# Altium schematic sheet 13hdmi_lcd.SchDoc
size C
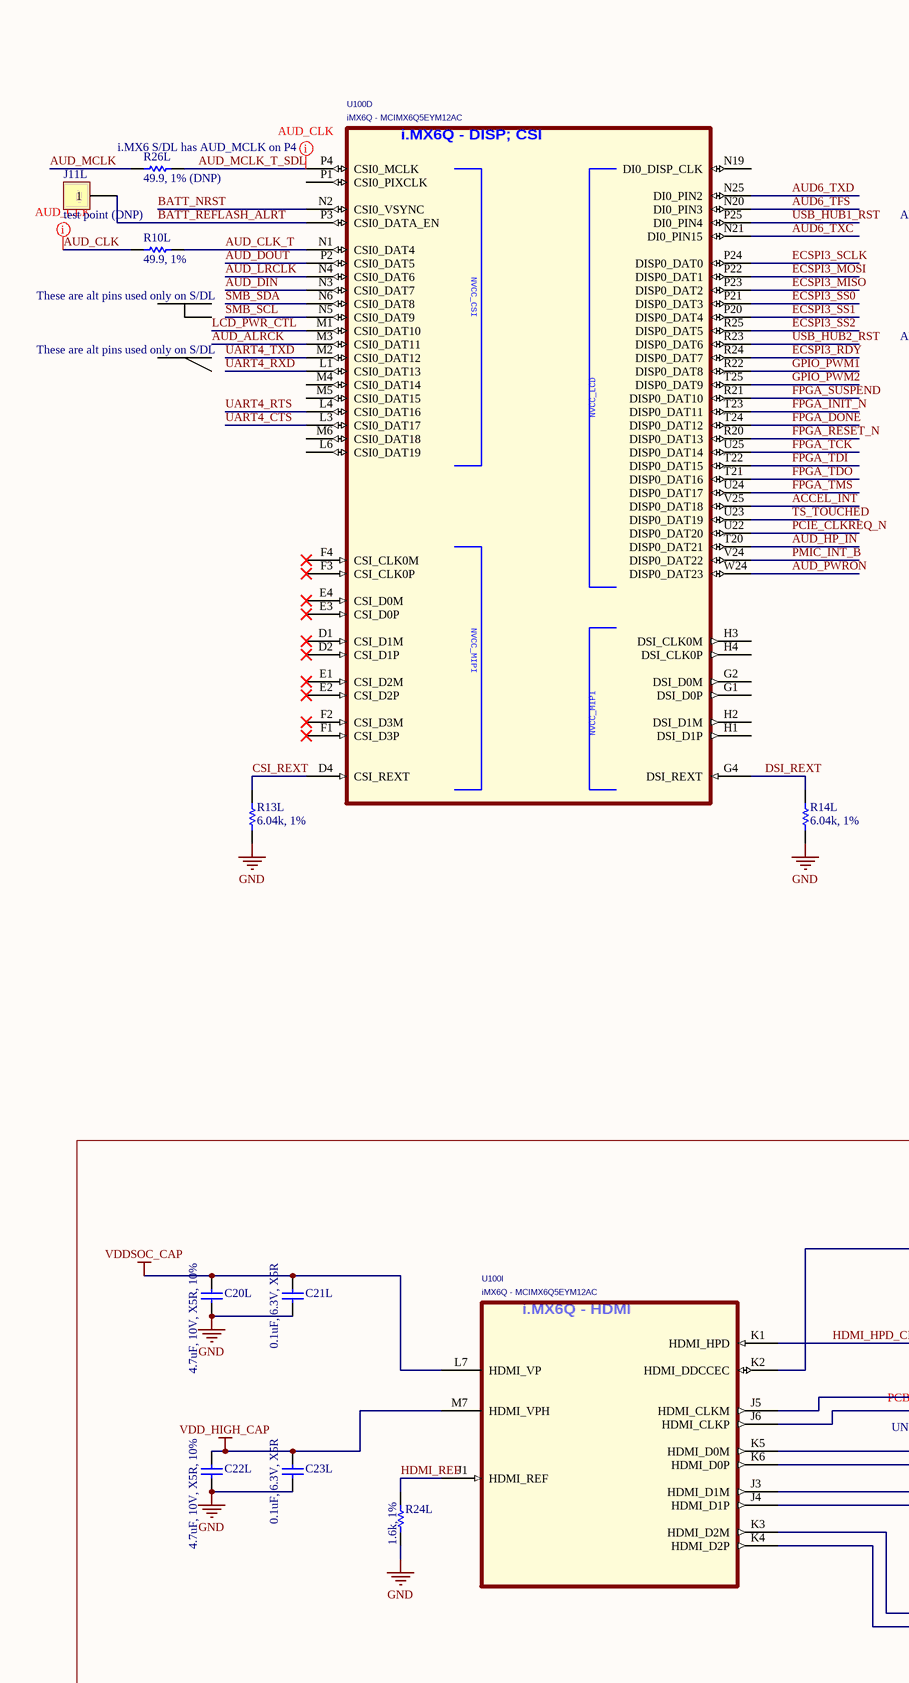
[diagram p0: 13hdmi_lcd.SchDoc, left]
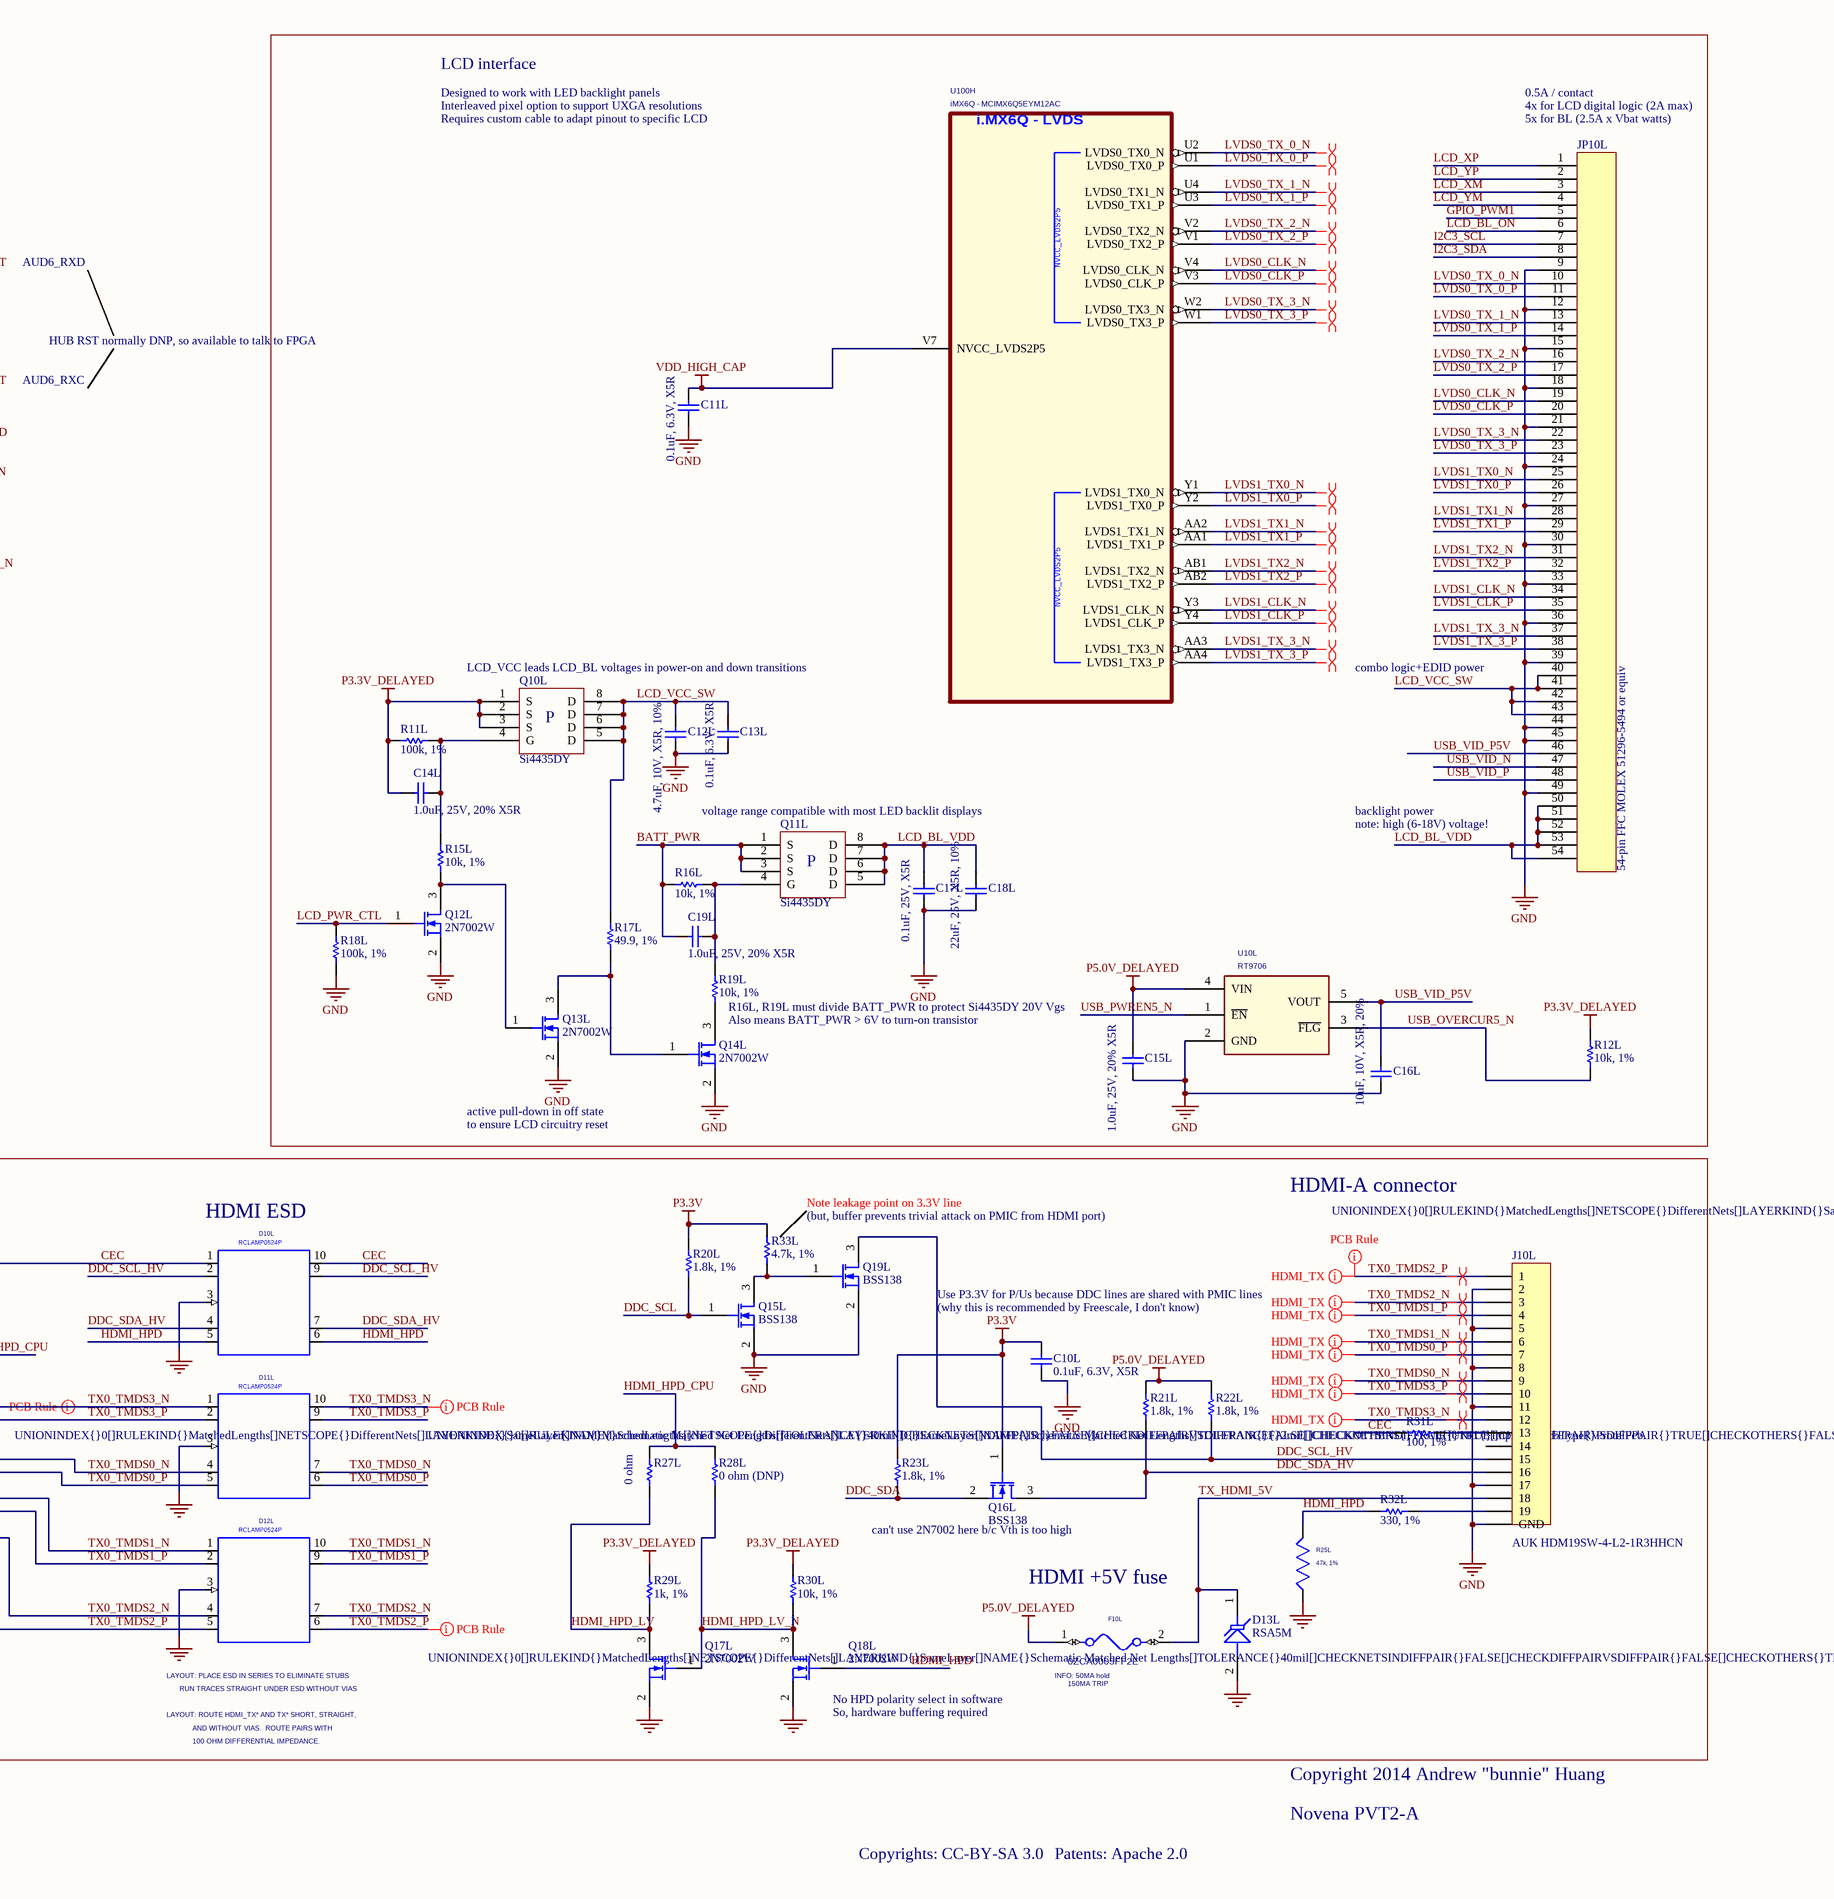
[diagram p1: 13hdmi_lcd.SchDoc, right]

## Parts
C10L  0.1uF, 6.3V, X5R  [CAPC0603N_B]
C11L  0.1uF, 6.3V, X5R  [CAPC0603N_B]
C12L  4.7uF, 10V, X5R, 10%  [CAPC1608N]
C13L  0.1uF, 6.3V, X5R  [CAPC0603N_B]
C14L  1.0uF, 25V, 20% X5R  [CAPC1608N]
C15L  1.0uF, 25V, 20% X5R  [CAPC1608N]
C16L  10uF, 10V, X5R, 20%  [CAPC1608N]
C17L  0.1uF, 25V, X5R  [CAPC1005N]
C18L  22uF, 25V, X5R, 10%  [CAPC3225N]
C19L  1.0uF, 25V, 20% X5R  [CAPC1608N]
C20L  4.7uF, 10V, X5R, 10%  [CAPC1608N_HD]
C21L  0.1uF, 6.3V, X5R  [CAPC0603N_B]
C22L  4.7uF, 10V, X5R, 10%  [CAPC1608N_HD]
C23L  0.1uF, 6.3V, X5R  [CAPC0603N_B]
D10L  RCLAMP0524P  [SEMTECH_SLP2510P8]  (value not drawn)
D11L  RCLAMP0524P  [SEMTECH_SLP2510P8]  (value not drawn)
D12L  RCLAMP0524P  [SEMTECH_SLP2510P8]  (value not drawn)
D13L  RSA5M  [SOD123/X.85]
F10L  0ZCA0005FF2E  [RESC3216N]
J10L  AUK HDM19SW-4-L2-1R3HHCN  [MOLEX_47151-0001]
J11L  test point (DNP)  [TP_SMT_38mil]
JP10L  54-pin FFC MOLEX 51296-5494 or equiv  [MOLEX_51296_5494]
Q10L  Si4435DY  [SOIC127P600-8AN]
Q11L  Si4435DY  [SOIC127P600-8AN]
Q12L  2N7002W  [SOT323-3AN]
Q13L  2N7002W  [SOT323-3AN]
Q14L  2N7002W  [SOT323-3AN]
Q15L  BSS138  [SOT23-3N]
Q16L  BSS138  [SOT23-3N]
Q17L  2N7002W  [SOT323-3AN]
Q18L  2N7002W  [SOT323-3AN]
Q19L  BSS138  [SOT23-3N]
R10L  49.9, 1%  [RESC1005N]
R11L  100k, 1%  [RESC1005N]
R12L  10k, 1%  [RESC1005N]
R13L  6.04k, 1%  [RESC1005N]
R14L  6.04k, 1%  [RESC1005N]
R15L  10k, 1%  [RESC1005N]
R16L  10k, 1%  [RESC1005N]
R17L  49.9, 1%  [RESC1005N]
R18L  100k, 1%  [RESC1005N]
R19L  10k, 1%  [RESC1005N]
R20L  1.8k, 1%  [RESC1005N]
R21L  1.8k, 1%  [RESC1005N]
R22L  1.8k, 1%  [RESC1005N]
R23L  1.8k, 1%  [RESC1005N]
R24L  1.6k, 1%  [RESC1005N]
R25L  47k, 1%  [RESC1005N]
R26L  49.9, 1% (DNP)  [RESC1005N]
R27L  0 ohm  [RESC1005N]
R28L  0 ohm (DNP)  [RESC1005N]
R29L  1k, 1%  [RESC1005N]
R30L  10k, 1%  [RESC1005N]
R31L  100, 1%  [RESC1005N]
R32L  330, 1%  [RESC1005N]
R33L  4.7k, 1%  [RESC1005N]
U10L  RT9706  [SOT23-5AN]
U100  iMX6Q - MCIMX6Q5EYM12AC  [FREESCALE_BGA624C80P25X25_2100X2100X216]  (parts D,H,I of 12)

## Blocks framed on the sheet
LCD interface: C11L C12L C13L C14L C15L C16L C17L C18L C19L JP10L Q10L Q11L Q12L Q13L Q14L R11L R12L R15L R16L R17L R18L R19L U10L U100

## Nets
GND: C10L.2 C11L.2 C12L.2 C13L.2 C15L.2 C16L.2 C17L.2 C18L.2 C20L.2 C21L.2 C22L.2 C23L.2 D10L.3(GND1) D11L.3(GND1) D12L.3(GND1) D13L.2(A) J10L.0(GND) J10L.2 J10L.5 J10L.8 J10L.11 J10L.17 JP10L.9 JP10L.12 JP10L.15 JP10L.18 JP10L.21 JP10L.24 JP10L.27 JP10L.30 JP10L.33 JP10L.36 JP10L.39 JP10L.44 JP10L.45 JP10L.49 Q12L.2(S) Q13L.2(S) Q14L.2(S) Q15L.2(S) Q17L.2(S) Q18L.2(S) Q19L.2(S) R13L.2 R14L.2 R18L.1 R24L.1 R25L.2(B) U10L.2(GND)
P3.3V: C10L.1 Q16L.1(G) R20L.1 R23L.1 R33L.1
P3.3V_DELAYED: C14L.1 Q10L.1(S) Q10L.2(S) Q10L.3(S) R11L.2 R12L.2 R29L.1 R30L.1
P5.0V_DELAYED: C15L.1 F10L.1 R21L.1 R22L.1 U10L.4(VIN)
VDD_HIGH_CAP: C11L.1 C22L.1 C23L.1 U100.M7(HDMI_VPH) U100.V7(NVCC_LVDS2P5)
VDDSOC_CAP: C20L.1 C21L.1 U100.L7(HDMI_VP)
ACCEL_INT: U100.V25(DISP0_DAT18)
AUD6_TFS: U100.N20(DI0_PIN3)
AUD6_TXC: U100.N21(DI0_PIN15)
AUD6_TXD: U100.N25(DI0_PIN2)
AUD_ALRCK: U100.M3(CSI0_DAT11)
AUD_CLK: R10L.2
AUD_CLK_T: R10L.1 U100.N1(CSI0_DAT4)
AUD_DIN: U100.N3(CSI0_DAT7)
AUD_DOUT: U100.P2(CSI0_DAT5)
AUD_HP_IN: U100.T20(DISP0_DAT21)
AUD_LRCLK: U100.N4(CSI0_DAT6)
AUD_MCLK: R26L.2
AUD_MCLK_T_SDL: R26L.1 U100.P4(CSI0_MCLK)
AUD_PWRON: U100.W24(DISP0_DAT23)
BATT_NRST: U100.N2(CSI0_VSYNC)
BATT_PWR: C19L.1 Q11L.1(S) Q11L.2(S) Q11L.3(S) R16L.2
BATT_REFLASH_ALRT: J11L.1 U100.P3(CSI0_DATA_EN)
CEC: D10L.1(IO1A) D10L.10(IO1B) R31L.2 U100.K2(HDMI_DDCCEC)
CSI_REXT: R13L.1 U100.D4(CSI_REXT)
DDC_SCL: Q15L.1(G) R20L.2
DDC_SCL_HV: D10L.2(IO2A) D10L.9(IO2B) J10L.15 Q19L.3(D) R22L.2
DDC_SDA: Q16L.2(S) R23L.2
DDC_SDA_HV: D10L.4(IO3A) D10L.7(IO3B) J10L.16 Q16L.3(D) R21L.2
DSI_REXT: R14L.1 U100.G4(DSI_REXT)
ECSPI3_MISO: U100.P23(DISP0_DAT2)
ECSPI3_MOSI: U100.P22(DISP0_DAT1)
ECSPI3_RDY: U100.R24(DISP0_DAT7)
ECSPI3_SCLK: U100.P24(DISP0_DAT0)
ECSPI3_SS0: U100.P21(DISP0_DAT3)
ECSPI3_SS1: U100.P20(DISP0_DAT4)
ECSPI3_SS2: U100.R25(DISP0_DAT5)
FPGA_DONE: U100.T24(DISP0_DAT12)
FPGA_INIT_N: U100.T23(DISP0_DAT11)
FPGA_RESET_N: U100.R20(DISP0_DAT13)
FPGA_SUSPEND: U100.R21(DISP0_DAT10)
FPGA_TCK: U100.U25(DISP0_DAT14)
FPGA_TDI: U100.T22(DISP0_DAT15)
FPGA_TDO: U100.T21(DISP0_DAT16)
FPGA_TMS: U100.U24(DISP0_DAT17)
GPIO_PWM1: JP10L.5 U100.R22(DISP0_DAT8)
GPIO_PWM2: U100.T25(DISP0_DAT9)
HDMI_HPD: D10L.5(IO4A) D10L.6(IO4B) Q18L.1(G) R25L.1(A) R32L.2
HDMI_HPD_CPU: R27L.1 R28L.1 U100.K1(HDMI_HPD)
HDMI_HPD_LV: Q17L.3(D) R27L.2 R29L.2
HDMI_HPD_LV_N: Q17L.1(G) Q18L.3(D) R28L.2 R30L.2
HDMI_REF: R24L.2 U100.J1(HDMI_REF)
I2C3_SCL: JP10L.7
I2C3_SDA: JP10L.8
LCD_BL_ON: JP10L.6
LCD_BL_VDD: C17L.1 C18L.1 JP10L.50 JP10L.51 JP10L.52 JP10L.53 JP10L.54 Q11L.5(D) Q11L.6(D) Q11L.7(D) Q11L.8(D)
LCD_PWR_CTL: Q12L.1(G) R18L.2 U100.M1(CSI0_DAT10)
LCD_VCC_SW: C12L.1 C13L.1 JP10L.40 JP10L.41 JP10L.42 JP10L.43 Q10L.5(D) Q10L.6(D) Q10L.7(D) Q10L.8(D) R17L.2
LCD_XM: JP10L.3
LCD_XP: JP10L.1
LCD_YM: JP10L.4
LCD_YP: JP10L.2
LVDS0_CLK_N: JP10L.19 U100.V4(LVDS0_CLK_N)
LVDS0_CLK_P: JP10L.20 U100.V3(LVDS0_CLK_P)
LVDS0_TX_0_N: JP10L.10 U100.U2(LVDS0_TX0_N)
LVDS0_TX_0_P: JP10L.11 U100.U1(LVDS0_TX0_P)
LVDS0_TX_1_N: JP10L.13 U100.U4(LVDS0_TX1_N)
LVDS0_TX_1_P: JP10L.14 U100.U3(LVDS0_TX1_P)
LVDS0_TX_2_N: JP10L.16 U100.V2(LVDS0_TX2_N)
LVDS0_TX_2_P: JP10L.17 U100.V1(LVDS0_TX2_P)
LVDS0_TX_3_N: JP10L.22 U100.W2(LVDS0_TX3_N)
LVDS0_TX_3_P: JP10L.23 U100.W1(LVDS0_TX3_P)
LVDS1_CLK_N: JP10L.34 U100.Y3(LVDS1_CLK_N)
LVDS1_CLK_P: JP10L.35 U100.Y4(LVDS1_CLK_P)
LVDS1_TX0_N: JP10L.25 U100.Y1(LVDS1_TX0_N)
LVDS1_TX0_P: JP10L.26 U100.Y2(LVDS1_TX0_P)
LVDS1_TX1_N: JP10L.28 U100.AA2(LVDS1_TX1_N)
LVDS1_TX1_P: JP10L.29 U100.AA1(LVDS1_TX1_P)
LVDS1_TX2_N: JP10L.31 U100.AB1(LVDS1_TX2_N)
LVDS1_TX2_P: JP10L.32 U100.AB2(LVDS1_TX2_P)
LVDS1_TX_3_N: JP10L.37 U100.AA3(LVDS1_TX3_N)
LVDS1_TX_3_P: JP10L.38 U100.AA4(LVDS1_TX3_P)
PCIE_CLKREQ_N: U100.U22(DISP0_DAT20)
PMIC_INT_B: U100.V24(DISP0_DAT22)
SMB_SCL: U100.N5(CSI0_DAT9)
SMB_SDA: U100.N6(CSI0_DAT8)
TS_TOUCHED: U100.U23(DISP0_DAT19)
TX0_TMDS0_N: D11L.4(IO3A) D11L.7(IO3B) J10L.9 U100.K5(HDMI_D0M)
TX0_TMDS0_P: D11L.5(IO4A) D11L.6(IO4B) J10L.7 U100.K6(HDMI_D0P)
TX0_TMDS1_N: D12L.1(IO1A) D12L.10(IO1B) J10L.6 U100.J3(HDMI_D1M)
TX0_TMDS1_P: D12L.2(IO2A) D12L.9(IO2B) J10L.4 U100.J4(HDMI_D1P)
TX0_TMDS2_N: D12L.4(IO3A) D12L.7(IO3B) J10L.3 U100.K3(HDMI_D2M)
TX0_TMDS2_P: D12L.5(IO4A) D12L.6(IO4B) J10L.1 U100.K4(HDMI_D2P)
TX0_TMDS3_N: D11L.1(IO1A) D11L.10(IO1B) J10L.12 U100.J5(HDMI_CLKM)
TX0_TMDS3_P: D11L.2(IO2A) D11L.9(IO2B) J10L.10 U100.J6(HDMI_CLKP)
TX_HDMI_5V: D13L.1(K) F10L.2 J10L.18
UART4_CTS: U100.L3(CSI0_DAT17)
UART4_RTS: U100.L4(CSI0_DAT16)
UART4_RXD: U100.L1(CSI0_DAT13)
UART4_TXD: U100.M2(CSI0_DAT12)
USB_HUB1_RST: U100.P25(DI0_PIN4)
USB_HUB2_RST: U100.R23(DISP0_DAT6)
USB_OVERCUR5_N: R12L.1 U10L.3(~{FLG})
USB_PWREN5_N: U10L.1(~{EN})
USB_VID_N: JP10L.47
USB_VID_P: JP10L.48
USB_VID_P5V: C16L.1 JP10L.46 U10L.5(VOUT)
NetC14L_2: C14L.2 Q10L.4(G) R11L.1 R15L.1
NetC19L_2: C19L.2 Q11L.4(G) R16L.1 R19L.1
NetJ10L_13: J10L.13 R31L.1
NetJ10L_19: J10L.19 R32L.1
NetQ12L_3: Q12L.3(D) Q13L.1(G) R15L.2
NetQ13L_3: Q13L.3(D) Q14L.1(G) R17L.1
NetQ14L_3: Q14L.3(D) R19L.2
NetQ15L_3: Q15L.3(D) Q19L.1(G) R33L.2

Not connected (* = marked no-connect by the designer): J10L 14; U100 D1(CSI_D1M)* D2(CSI_D1P)* E1(CSI_D2M)* E2(CSI_D2P)* E3(CSI_D0P)* E4(CSI_D0M)* F1(CSI_D3P)* F2(CSI_D3M)* F3(CSI_CLK0P)* F4(CSI_CLK0M)* G1(DSI_D0P) G2(DSI_D0M) H1(DSI_D1P) H2(DSI_D1M) H3(DSI_CLK0M) H4(DSI_CLK0P) L6(CSI0_DAT19) M4(CSI0_DAT14) M5(CSI0_DAT15) M6(CSI0_DAT18) N19(DI0_DISP_CLK) P1(CSI0_PIXCLK)

## Layout directives
differential pair: LVDS0_CLK_N, LVDS0_CLK_P, LVDS0_TX_0_N, LVDS0_TX_0_P, LVDS0_TX_1_N, LVDS0_TX_1_P, LVDS0_TX_2_N, LVDS0_TX_2_P, LVDS0_TX_3_N, LVDS0_TX_3_P, LVDS1_CLK_N, LVDS1_CLK_P, LVDS1_TX0_N, LVDS1_TX0_P, LVDS1_TX1_N, LVDS1_TX1_P, LVDS1_TX2_N, LVDS1_TX2_P, LVDS1_TX_3_N, LVDS1_TX_3_P, TX0_TMDS0_N, TX0_TMDS0_P, TX0_TMDS1_N, TX0_TMDS1_P, TX0_TMDS2_N, TX0_TMDS2_P, TX0_TMDS3_N, TX0_TMDS3_P
net class HDMI_TX: TX0_TMDS0_N, TX0_TMDS0_P, TX0_TMDS1_N, TX0_TMDS1_P, TX0_TMDS2_N, TX0_TMDS2_P, TX0_TMDS3_N, TX0_TMDS3_P
rule Matched Net Lengths [Tolerance = 40mil]: TX0_TMDS2_P, TX0_TMDS3_N
rule Matched Net Lengths [Tolerance = 2mil]: TX0_TMDS2_P, TX0_TMDS3_N
net class AUD_CLK: AUD_CLK, AUD_MCLK_T_SDL

## Notes on the sheet
- Designed to work with LED backlight panels
- Interleaved pixel option to support UXGA resolutions
- Requires custom cable to adapt pinout to specific LCD
- 0.5A / contact
- 4x for LCD digital logic (2A max)
- (near JP10L) 5x for BL (2.5A x Vbat watts)
- (near R26L) i.MX6 S/DL has AUD_MCLK on P4
- AUD6_RXD
- (near R10L) These are alt pins used only on S/DL
- AUD6_RXC
- HUB RST normally DNP, so available to talk to FPGA
- These are alt pins used only on S/DL
- (near Q10L) LCD_VCC leads LCD_BL voltages in power-on and down transitions
- combo logic+EDID power
- (near Q11L) voltage range compatible with most LED backlit displays
- backlight power
- note: high (6-18V) voltage!
- (near R19L) R16L, R19L must divide BATT_PWR to protect Si4435DY 20V Vgs
- Also means BATT_PWR > 6V to turn-on transistor
- active pull-down in off state
- to ensure LCD circuitry reset
- (near D10L) HDMI ESD
- Note leakage point on 3.3V line
- (but, buffer prevents trivial attack on PMIC from HDMI port)
- HDMI-A connector
- Use P3.3V for P/Us because DDC lines are shared with PMIC lines
- (near C10L) (why this is recommended by Freescale, I don't know)
- can't use 2N7002 here b/c Vth is too high
- HDMI +5V fuse
- (near D12L) LAYOUT: PLACE ESD IN SERIES TO ELIMINATE STUBS
- RUN TRACES STRAIGHT UNDER ESD WITHOUT VIAS
- (near F10L) INFO: 50MA hold
- (near F10L) 150MA TRIP
- LAYOUT: ROUTE HDMI_TX* AND TX* SHORT, STRAIGHT,
- 100 OHM DIFFERENTIAL IMPEDANCE.
- AND WITHOUT VIAS.  ROUTE PAIRS WITH
- (near Q18L) No HPD polarity select in software
- (near Q18L) So, hardware buffering required
- Copyright 2014 Andrew "bunnie" Huang
- Novena PVT2-A
- Copyrights: CC-BY-SA 3.0
- Patents: Apache 2.0
- (in symbol PCIMX6Q6VV1A, part D) i.MX6Q - DISP; CSI
- (in symbol PCIMX6Q6VV1A, part H) i.MX6Q - LVDS
- (in symbol PCIMX6Q6VV1A, part I) i.MX6Q - HDMI
- (in symbol Si4435DY) P

## Library data of the parts
C10L C11L C12L C13L C14L C15L C16L C17L C18L C19L C20L C21L C22L C23L = Cap Semi: Capacitor (Semiconductor SIM Model); Published: 8-Jun-2000; LatestRevisionDate: 17-Jul-2002; LatestRevisionNote: Re-released for DXP Platform.; PackageReference: C1206; Publisher: Altium Limited
D10L D11L D12L = RCLAMP0524P: PART_NUMBER: V00004-001; CDS_LMAN_SYM_OUTLINE: -175,225,175,-175; MATERIAL: IC; PACK_TYPE: SLP1610P4; PATH: I24; OriginalSymbolOrigin: (-175,225); LOCATION: D8; XY: (-2475,4175); VER: 1; ROT: 0; PHYS_PAGE: 10; DRAWING: @BROWNSTONE_LIB.BROWNSTONE(SCH_1):PAGE10; CDS_LIB: integrated_circuits; SEC_TYPE: SLP1610P4; SEC: 1; CDS_LOCATION: D8; $LOCATION: D8
D13L = Tranzorb: Published: 24-Mar-1999; LatestRevisionDate: 17-Jul-2002; LatestRevisionNote: Re-released for DXP Platform.; PackageReference: DO-7; Publisher: Altium Limited
F10L = FUSE0805: BelFuse, 50mA hold, 150mA trip; PART_NUMBER: M00014-001; CDS_LMAN_SYM_OUTLINE: -75,50,75,-50; OriginalSymbolOrigin: (-125,50); LOCATION: F1; XY: (-4350,3000); VER: 1; ROT: 0; PHYS_PAGE: 10; PATH: I13; MATERIAL: FUSE; DRAWING: @BROWNSTONE_LIB.BROWNSTONE(SCH_1):PAGE10; CDS_LIB: fuses; SEC_TYPE: FUSE0805; SEC: 1; PACK_TYPE: FUSE0805; CDS_LOCATION: F1; $LOCATION: F1
J10L = Header 19: Molex HDMI connector, Type A; LatestRevisionDate: 17-Jul-2002; LatestRevisionNote: Re-released for DXP Platform.; Publisher: Altium Limited
J11L = CON1: Connector
JP10L = HEADER_54: Flat flex connector, 54 positions
Q10L Q11L = Si4435DY: Singre P-channel FET, 8A, 30V
Q12L Q13L Q14L Q15L Q16L Q17L Q18L Q19L = MOSFET-N: N-Channel MOSFET; Published: 8-Jun-2000; LatestRevisionDate: 17-Jul-2002; LatestRevisionNote: Re-released for DXP Platform.; PackageVersion: 1995/1996; PackageReference: E3; Publisher: Altium Limited
R10L R12L R13L R14L R15L R16L R17L R19L R20L R21L R22L R23L R24L R26L R27L R28L R29L R30L R31L R32L R33L = Res1: Resistor; Value: 100k; Published: 8-Jun-2000; LatestRevisionDate: 17-Jul-2002; LatestRevisionNote: Re-released for DXP Platform.; PackageReference: AXIAL-0.3; Publisher: Altium Limited
R11L R18L = Res1: Resistor; Published: 8-Jun-2000; LatestRevisionDate: 17-Jul-2002; LatestRevisionNote: Re-released for DXP Platform.; PackageReference: AXIAL-0.3; Publisher: Altium Limited; Value: 100k
R25L = RES#1: PART_NUMBER: D13015-001; NEEDS_NO_SIZE: TRUE; PACK_TYPE: RES0402; PATH: I12; WATTAGE: 1/16W; OriginalSymbolOrigin: (-50,100); LOCATION: R125; SEC: 1; XY: (-1400,3050); VER: 2; ROT: 0; PHYS_PAGE: 10; MFG_PN: ERJ-2RKF1002X; MFG: PANASONIC; DRAWING: @BROWNSTONE_LIB.BROWNSTONE(SCH_1):PAGE10; CDS_LIB: resistors; MATERIAL: CH; TOL: 1%; TOLERENCE: ?; CDS_SEC: 1; CDS_LOCATION: R125; $TOLERENCE: ?; $SEC: 1; $LOCATION: R125
U10L = RT9706: IC LIN SW W/FLAG 500MA 2.0-5.5V SOT23-5; AGILE_PN: 315-77830; MFG_NAME01: RICHTEK; MFG_PN01: RT9706PB; CAD_APPROVED: Yes; ROHS: Yes; HEIGHT: 1.295MM
U100 = PCIMX6Q6VV1A: PCIMX6Q5EVT10AC; AGILE_PN: TMP-WF-14526; MFG_NAME01: Freescale Semiconductor; PRE_APN: 344-01218; MFG_PN01: PCIMX6Q6VV1A; ROHS: Yes; HEIGHT: 2.16MM